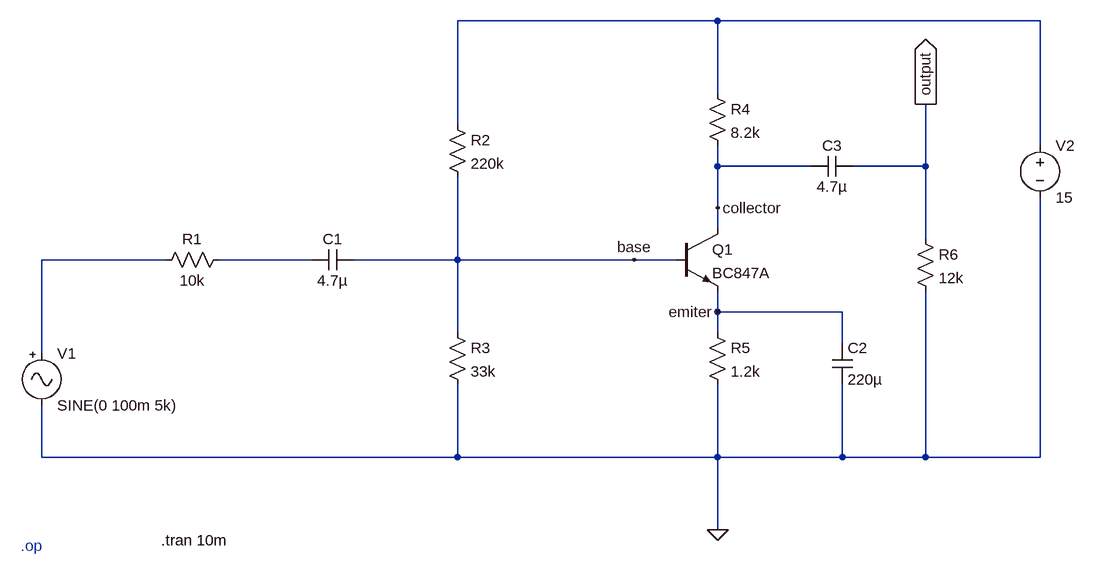
[diagram p0: schematic ac_signal_bjt_kuvvetlendirici.asc]
ac_signal_bjt_kuvvetlendirici.asc, the LTspice schematic file:
Version 4
SHEET 1 1592 680
WIRE 1040 -336 640 -336
WIRE 1536 -336 1040 -336
WIRE 1040 -224 1040 -336
WIRE 640 -176 640 -336
WIRE 1536 -144 1536 -336
WIRE 1040 -112 1040 -144
WIRE 1184 -112 1040 -112
WIRE 1360 -112 1360 -208
WIRE 1360 -112 1248 -112
WIRE 1040 -48 1040 -112
WIRE 1040 -16 1040 -48
WIRE 1360 0 1360 -112
WIRE 192 32 0 32
WIRE 416 32 272 32
WIRE 640 32 640 -96
WIRE 640 32 480 32
WIRE 912 32 640 32
WIRE 976 32 912 32
WIRE 1040 112 1040 80
WIRE 1232 112 1040 112
WIRE 640 144 640 32
WIRE 1040 144 1040 112
WIRE 1232 160 1232 112
WIRE 0 176 0 32
WIRE 0 336 0 256
WIRE 640 336 640 224
WIRE 640 336 0 336
WIRE 1040 336 1040 224
WIRE 1040 336 640 336
WIRE 1232 336 1232 224
WIRE 1232 336 1040 336
WIRE 1360 336 1360 80
WIRE 1360 336 1232 336
WIRE 1536 336 1536 -64
WIRE 1536 336 1360 336
WIRE 1040 448 1040 336
FLAG 1040 448 0
FLAG 1360 -208 output
IOPIN 1360 -208 Out
FLAG 912 32 base
FLAG 1040 -48 collector
FLAG 1040 112 emiter
SYMBOL Misc\\signal 0 160 R0
WINDOW 123 0 0 Left 0
WINDOW 39 0 0 Left 0
SYMATTR InstName V1
SYMATTR Value SINE(0 100m 5k)
SYMBOL res 288 16 R90
WINDOW 0 0 56 VBottom 2
WINDOW 3 32 56 VTop 2
SYMATTR InstName R1
SYMATTR Value 10k
SYMBOL cap 480 16 R90
WINDOW 0 0 32 VBottom 2
WINDOW 3 32 32 VTop 2
SYMATTR InstName C1
SYMATTR Value 4.7µ
SYMBOL res 624 -192 R0
SYMATTR InstName R2
SYMATTR Value 220k
SYMBOL res 624 128 R0
SYMATTR InstName R3
SYMATTR Value 33k
SYMBOL res 1024 -240 R0
SYMATTR InstName R4
SYMATTR Value 8.2k
SYMBOL npn 976 -16 R0
SYMATTR InstName Q1
SYMATTR Value BC847A
SYMBOL res 1024 128 R0
SYMATTR InstName R5
SYMATTR Value 1.2k
SYMBOL cap 1216 160 R0
SYMATTR InstName C2
SYMATTR Value 220µ
SYMBOL voltage 1536 -160 R0
WINDOW 123 0 0 Left 0
WINDOW 39 0 0 Left 0
SYMATTR InstName V2
SYMATTR Value 15
SYMBOL cap 1248 -128 R90
WINDOW 0 0 32 VBottom 2
WINDOW 3 32 32 VTop 2
SYMATTR InstName C3
SYMATTR Value 4.7µ
SYMBOL res 1344 -16 R0
SYMATTR InstName R6
SYMATTR Value 12k
TEXT -32 472 Left 2 ;.op
TEXT 184 464 Left 2 !.tran 10m

The netlist it stands for:
* ac_signal_bjt_kuvvetlendirici.asc
V1 N002 0 SINE(0 100m 5k)
R1 N003 N002 10k
C1 base N003 4.7µ
R2 N001 base 220k
R3 base 0 33k
R4 N001 collector 8.2k
Q1 collector base emiter 0 BC847A
R5 emiter 0 1.2k
C2 emiter 0 220µ
V2 N001 0 15
C3 output collector 4.7µ
R6 output 0 12k
.model NPN NPN
.model PNP PNP
.lib standard.bjt
* .op
.tran 10m
.backanno
.end